# EAGLE design EPGinputDB (EAGLE 7.7.0)
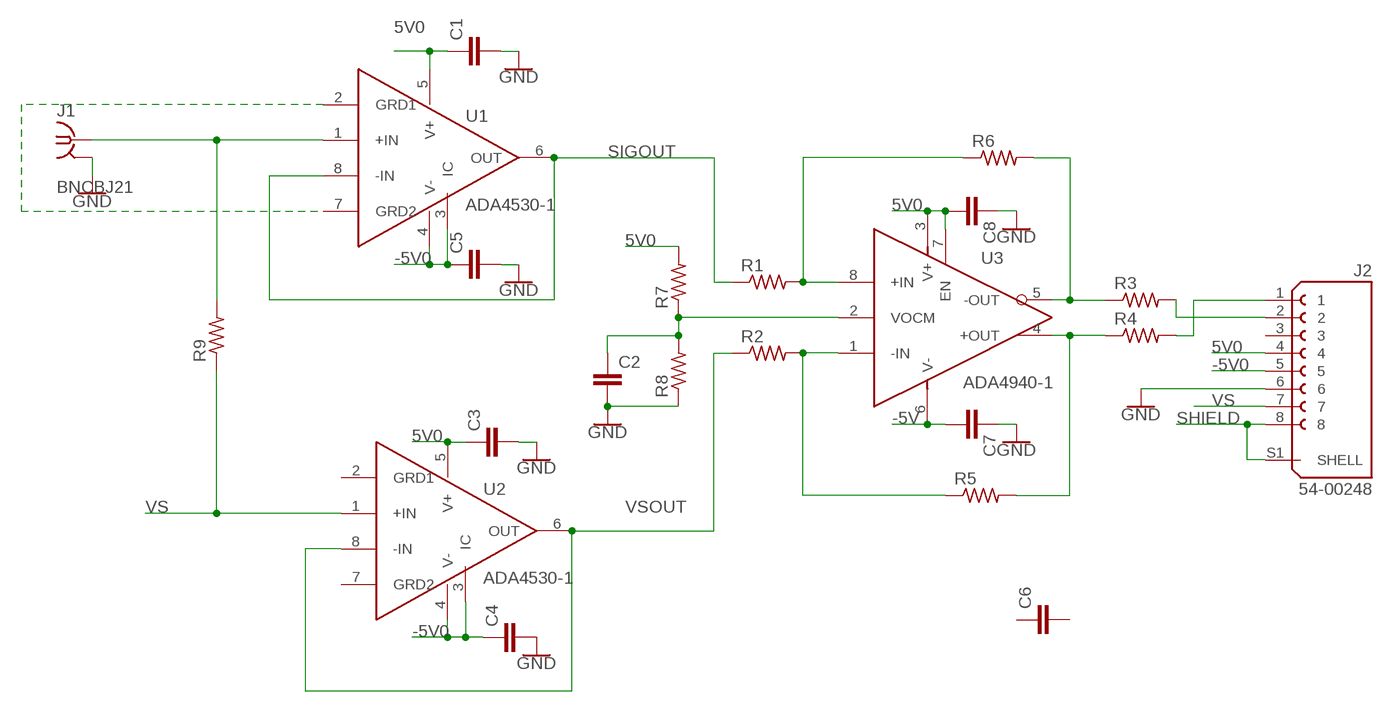
[diagram p0: schematic, sheet 1]

## Parts
C1  CAPS0603S  [0603S]
C2  CAPS0603S  [0603S]
C3  CAPS0603S  [0603S]
C4  CAPS0603S  [0603S]
C5  CAPS0603S  [0603S]
C6  CAPS0603S  [0603S]
C7  CAPS0603S  [0603S]
C8  CAPS0603S  [0603S]
J1  BNCBJ21  [BNC-BJ21]
J2  54-00248  [TENSILITY_54-00248]
R1  RESISTOR_SM0805S  [0805S]
R2  RESISTOR_SM0805S  [0805S]
R3  RESISTOR_SM0805S  [0805S]
R4  RESISTOR_SM0805S  [0805S]
R5  RESISTOR_SM0805S  [0805S]
R6  RESISTOR_SM0805S  [0805S]
R7  RESISTOR_SM0805S  [0805S]
R8  RESISTOR_SM0805S  [0805S]
R9  R-US_0617/22  [0617/22]
U1  ADA4530-1  [SOIC-8]
U2  ADA4530-1  [SOIC-8]
U3  ADA4940-1  [SOIC-8]

## Nets
5V0: C1.1 C3.1 C8.2 J2.4 R7.2 U1.5(V+) U2.5(V+) U3.3(V+) U3.7(EN)
-5V: C7.2 U3.6(V-)
-5V0: C4.1 C5.1 J2.5 U1.3(IC) U1.4(V-) U2.3(IC) U2.4(V-)
GND: C1.2 C2.2 C3.2 C4.2 C5.2 C7.1 C8.1 J1.P$1(GND) J2.6 R8.1
N$1: C2.1 R7.1 R8.2 U3.2(VOCM)
N$2: J1.P$2 R9.2 U1.1(+IN)
N$3: U1.2(GRD1) U1.7(GRD2)
N$6: R1.2 R6.1 U3.8(+IN)
N$7: R2.2 R5.1 U3.1(-IN)
N$9: J2.2 R3.2
N$10: J2.1 R4.2
N$19: R4.1 R5.2 U3.4(+OUT)
N$20: R3.1 R6.2 U3.5(-OUT)
SHIELD: J2.8 J2.S1(SHELL)
SIGOUT: R1.1 U1.6(OUT) U1.8(-IN)
VS: J2.7 R9.1 U2.1(+IN)
VSOUT: R2.1 U2.6(OUT) U2.8(-IN)
Unconnected: C6.1 C6.2 J2.3 U2.2(GRD1) U2.7(GRD2)

## Library data of the parts
C1-C8 = STEVES_BU:CAPS
J1 = STEVES_BU:BNC
J2 = 54-00248:54-00248; MANUFACTURER: Tensility; MAXIMUM_PACKAGE_HEIGHT: 16mm; PARTREV: A1; STANDARD: Manufacturer Recommendations
R1-R8 = STEVES_BU:RESISTOR_SM
R9 = resistor:R-US_: RESISTOR, American symbol
U1 U2 = EPG:ADA4530-1
U3 = EPG:ADA4940-1

## Board
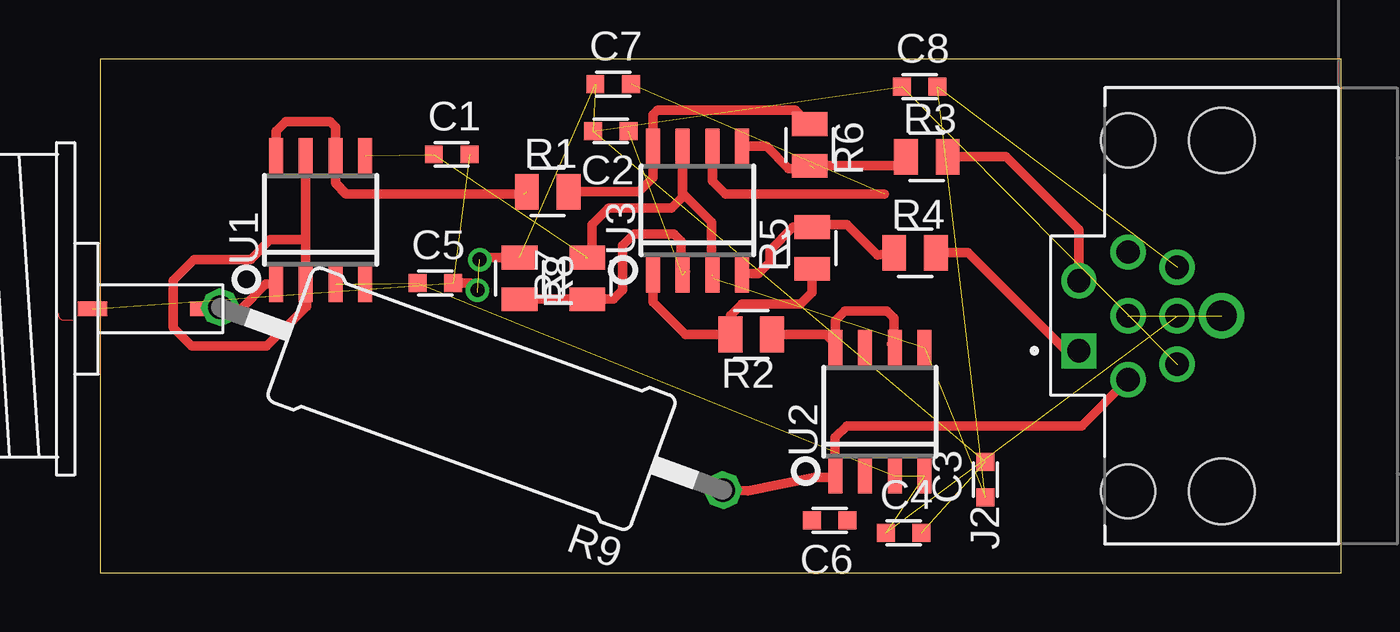
[diagram p1: board, top side]
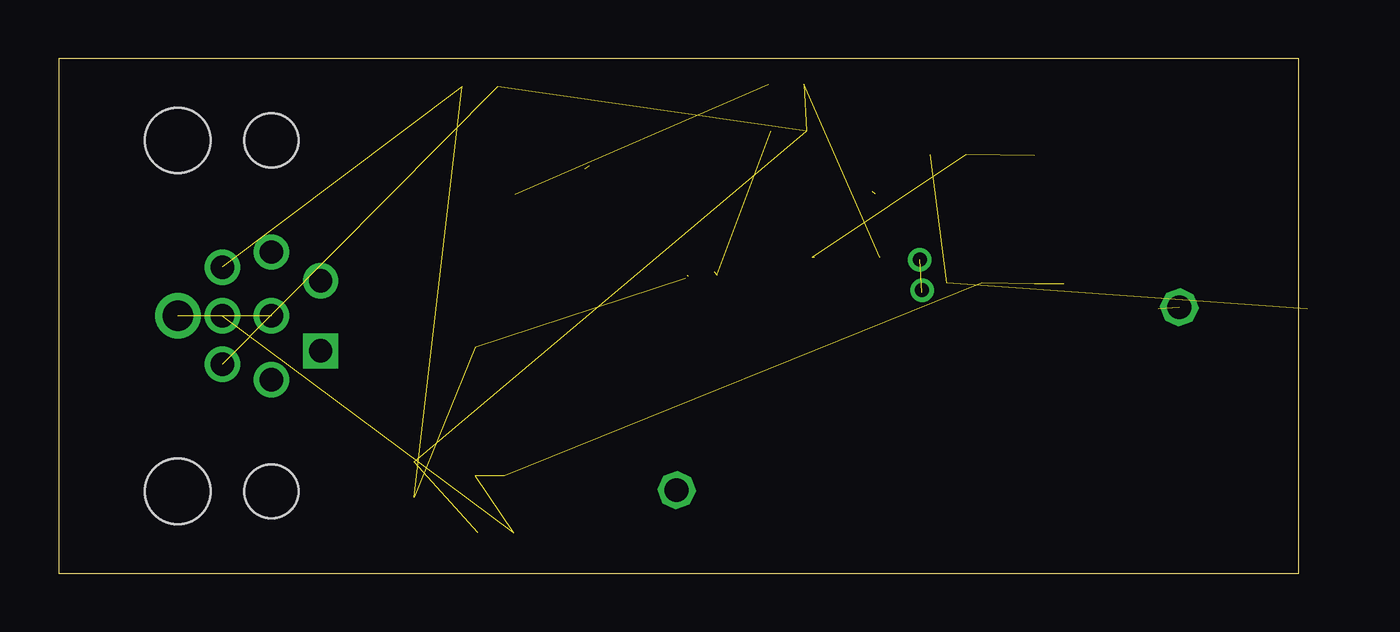
[diagram p2: board, bottom side, seen from below]

Size 53 x 22 mm. Coordinates in mm from the lower left corner, seen from the top.
Outline: 0,22 53,22 53,0 0,0 0,22
Copper layers (1*16): Top 0.035mm / dielectric 1.5mm / Bottom 0.035mm
Design rules "default": minimum track width 10mil, minimum drill 24mil, track to track 8mil, track to pad 8mil, pad to pad 8mil, via to via 8mil, smd to smd 8mil, copper to edge 40mil, drill to drill 8mil, minimum pad ring 10mil, minimum via ring 8mil, stop-mask expansion 4mil, vias tented up to drill 0mil, thermal gap 10mil

### Footprints (pad centres in the part's own frame; a part is rotated, then mirrored left to right if it is on the bottom)
0603S = smd 0.762 x 0.762: 1 -0.762,0; 2 0.762,0
BNC-BJ21 = smd 0.635 x 1.27: P$1 0,12.954; P$2 0,8.128
TENSILITY_54-00248 = drill 1 pad 1.4 square: 1 -1.5,2.1 | drill 1 pad 1.4: 2 1.5,2.1; 3 2.725,0; 4 2.075,-2.1; 5 0,-2.1; 6 -2.075,-2.1; 7 -2.725,0; 8 0,0 | drill 1.3 pad 1.7: S1 0,-4 | hole 2.3: -7.5,0; 7.5,0 | hole 2.8: -7.5,-4; 7.5,-4
0805S = smd 1.016 x 1.524: 1 -0.889,0; 2 0.889,0
0617/22 = drill 1.016 octagon: 1 -11.43,0; 2 11.43,0
SOIC-8 = smd 0.6 x 1.5: 1 -1.905,-2.75; 2 -0.635,-2.75; 3 0.635,-2.75; 4 1.905,-2.75; 5 1.905,2.75; 6 0.635,2.75; 7 -0.635,2.75; 8 -1.905,2.75

### Placement (x,y rotation side)
C1  15,17.9 0 top
C2  21.8,18.9 180 top
C3  37.8,4 90 top
C4  34.32,1.72 0 top
C5  14.3,12.4 0 top
C6  31.15,2.26 180 top
C7  21.9,20.9 0 top
C8  35,20.8 0 top
J1  12.6,11.3 90 top
J2  43.9,11 90 top
R1  19.1,16.3 0 top
R2  27.8,10.2 180 top
R3  35.3,17.8 0 top
R4  34.8,13.7 0 top
R5  30.4,13.9 90 top
R6  30.3,18.3 270 top
R7  20.8,12.6 90 top
R8  17.9,12.6 270 top
R9  15.85,7.45 160 top
U1  9.4,15.1 0 top
U2  33.3,6.9 0 top
U3  25.5,15.5 0 top

### Tracks (layer width: path | path; a pad name or v marks a point on that pad's centre or on a via)
5V0  (8 unrouted)
  Top 0.406: U3.7 24.86,16.23 | 24.86,16.23 26.1,15 26.1,12.7 26.2,12.6 | 24.86,16.23 24.86,16.07 24.4,15.6 21.7,15.6 21,14.9 21,13.8 20.7,13.5
-5V  (1 unrouted)
  Top 0.406: U3.6 26.13,16.77 26.7,16.2 33.5,16.2
-5V0  (6 unrouted)
GND  (via drill 0.6)  (9 unrouted)
  Top 0.406: R8.1 16.29,13.49 v16.2,13.4 | C5.2 15.8,12.4 v16.1,12.1
  Bottom 0.406: v16.2,13.4 16.2,13.3 | v16.1,12.1 16.1,12
N$1  (2 unrouted)
  Top 0.406: R8.2 R7.1 21.91,11.71 22.3,12.1 22.3,14 22.8,14.5 24.5,14.5 24.8,14.2 24.8,13.1 25,12.9
N$2  (1 unrouted)
  Top 0.406: U1.1 7.05,12.35 6,11.3 J1.P$2
N$3
  Top 0.406: U1.7 8.76,14.25 | 8.76,14.25 U1.2 | 8.76,14.25 7.25,14.25 6.4,13.4 4,13.4 3.1,12.5 3.1,10.5 3.9,9.7 7.1,9.7 8.8,11.4 8.8,12.3 8.7,12.4 8.7,12.6
N$4
  Top 0: -1.2,10.8 -1.55,10.8 arc-90 -1.8,11.05 -1.8,11.1
N$6
  Top 0.406: R1.2 23,16.3 23.6,16.9 U3.8 23.59,19.59 23.8,19.8 29.69,19.8 R6.1
N$7
  Top 0.406: U3.1 23.6,11.6 25,10.2 R2.2 26.91,11.01 27.4,11.5 29.9,11.5 30.4,12 R5.1 | R5.1 30.4,13.1 30.3,13.2 30.3,13.11 R5.1
N$9
  Top 0.406: R3.2 38.68,17.8 41.8,14.68 J2.2
N$10
  Top 0.406: R4.2 37.07,13.7 41.42,9.35 41.65,9.35 J2.1
N$19
  Top 0.406: U3.4 27.45,12.8 28.1,12.8 28.6,13.3 28.6,13.8 29.59,14.79 R5.2 30.51,14.9 31.9,14.9 33.2,13.6 R4.1
N$20  (1 unrouted)
  Top 0.406: U3.5 28.45,18.25 29.4,17.3 30.5,17.3 30.5,17.2 | R6.2 34.3,17.41 R3.1
SHIELD  (1 unrouted)
SIGOUT  (1 unrouted)
  Top 0.406: 18.1,16.2 10.5,16.2 10.04,16.66 U1.6 10.04,19.06 9.8,19.3 7.9,19.3 7.5,18.9 U1.8
VS
  Top 0.406: R9.1 27.66,3.51 30.5,4.1 31.34,4.1 U2.1 31.39,4.16 31.39,5.79 31.89,6.3 41.93,6.3 J2.7
VSOUT
  Top 0.406: U2.8 31.39,9.8 | 31.39,9.8 31.39,10.79 31.8,11.2 33.6,11.2 33.9,10.9 33.9,9.8 | 33.9,9.8 33.9,9.69 U2.6 33.94,9.66 33.8,9.8 33.9,9.8 | R2.1 31,10.2 31.39,9.8